# EAGLE schematic New2 (EAGLE 6.1)
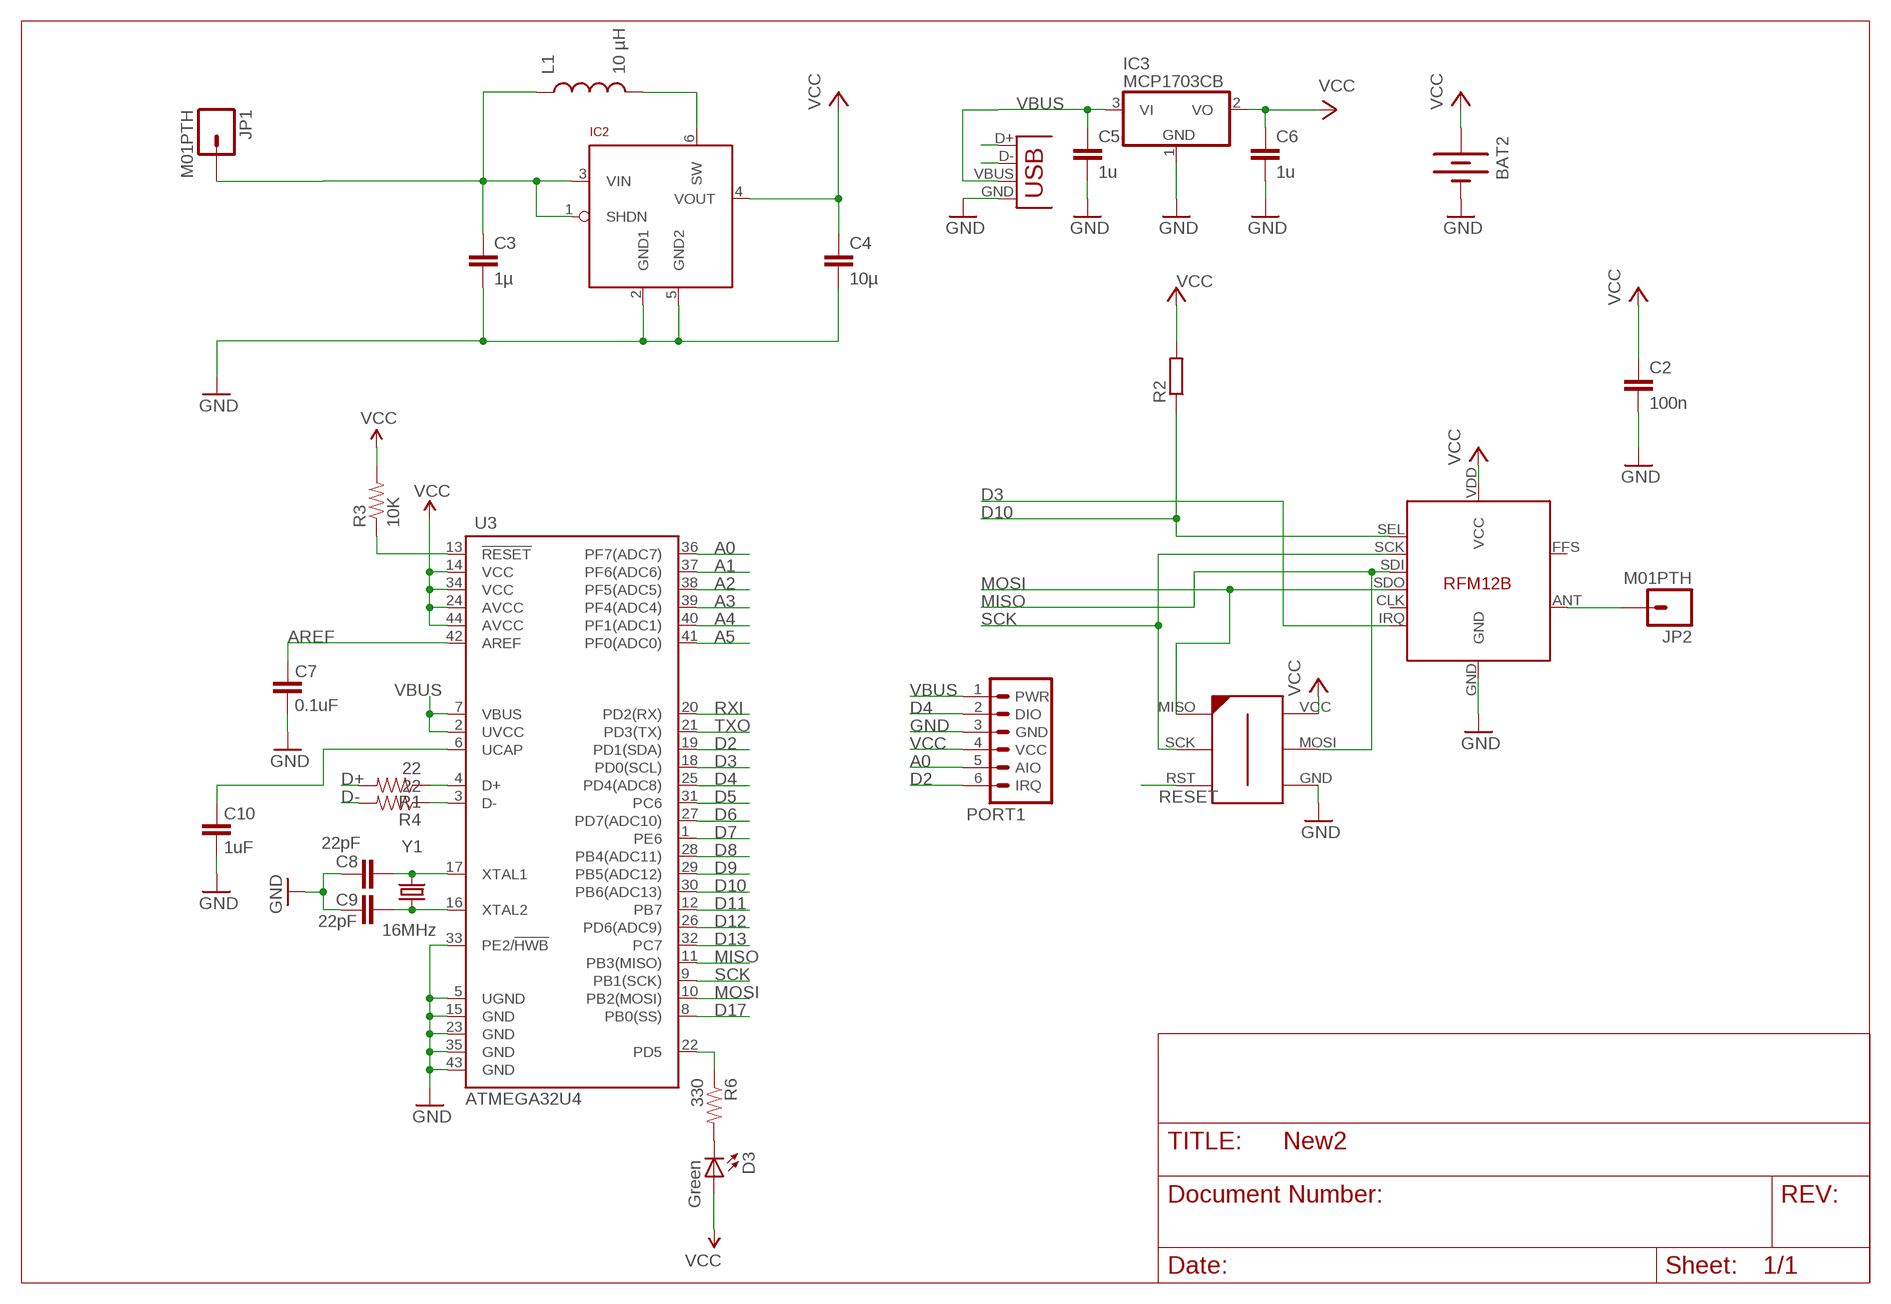
[diagram p0: schematic, sheet 1]

## Parts
BAT2  BATTERY20PTH  [BATTCOM_20MM_PTH]
C2  100n  C-EUC0603K  [C0603K]
C3  1µ  CAP0603-CAP  [0603-CAP]
C4  10µ  CAP0805  [0805]
C5  1u  C-EUC0603K  [C0603K]
C6  1u  C-EUC0603K  [C0603K]
C7  0.1uF  CAP0402-CAP  [0402-CAP]
C8  22pF  CAP0402-CAP  [0402-CAP]
C9  22pF  CAP0402-CAP  [0402-CAP]
C10  1uF  CAP0402-CAP  [0402-CAP]
D3  Green  LED0603  [LED-0603]
IC2  LTC3525  [SC70]
IC3  MCP1703CB  [SOT23]
JP1  M01PTH  [1X01]
JP2  M01PTH  [1X01]
L1  10 µH  INDUCTOR1210  [1210]
PORT1  JEEPORT-FEMALE  [1X06_FEMALE_LOCK.010]
R1  22  RESISTOR0402-RES  [0402-RES]
R2  R-EU_R0402  [R0402]
R3  10K  RESISTOR0402-RES  [0402-RES]
R4  22  RESISTOR0402-RES  [0402-RES]
R6  330  RESISTOR0402-RES  [0402-RES]
U3  ATMEGA32U4  ATMEGA32U4QFN2  [QFN-44-NOPAD]
U$1  RFM12B  [RFM12B]
U$2  AVR-ISP-6-EDGE  [6PAD_ISP]
X1  USB-MICROB  [USB-MICROB]
Y1  16MHz  CRYSTAL5X3  [CRYSTAL-SMD-5X3]

## Nets
A0: PORT1.5(AIO) U3.36(PF7(ADC7))
A1: U3.37(PF6(ADC6))
A2: U3.38(PF5(ADC5))
A3: U3.39(PF4(ADC4))
A4: U3.40(PF1(ADC1))
A5: U3.41(PF0(ADC0))
AREF: C7.2 U3.42(AREF)
D2: PORT1.6(IRQ) U3.19(PD1(SDA))
D3: U3.18(PD0(SCL)) U$1.IRQ
D4: PORT1.2(DIO) U3.25(PD4(ADC8))
D5: U3.31(PC6)
D6: U3.27(PD7(ADC10))
D7: U3.1(PE6)
D8: U3.28(PB4(ADC11))
D9: U3.29(PB5(ADC12))
D10: R2.1 U3.30(PB6(ADC13)) U$1.SEL
D11: U3.12(PB7)
D12: U3.26(PD6(ADC9))
D13: U3.32(PC7)
D17: U3.8(PB0(SS))
D+: R1.2 X1.D+
D-: R4.2 X1.D-
GND: BAT2.2(-) C2.2 C3.2 C4.2 C5.2 C6.2 C7.1 C8.2 C9.2 C10.1 IC2.2(GND1) IC2.5(GND2) IC3.1(GND) PORT1.3(GND) U3.5(UGND) U3.15(GND) U3.23(GND) U3.33(PE2/!HWB) U3.35(GND) U3.43(GND) U$1.GND U$2.GND X1.GND
MISO: U3.11(PB3(MISO)) U$1.SDI U$2.MOSI
MOSI: U3.10(PB2(MOSI)) U$1.SDO U$2.MISO
N$1: C9.1 U3.16(XTAL2) Y1.1
N$2: R1.1 U3.4(D+)
N$3: JP2.1 U$1.ANT
N$4: C8.1 U3.17(XTAL1) Y1.3
N$5: C10.2 U3.6(UCAP)
N$6: D3.C R6.2
N$7: R4.1 U3.3(D-)
N$13 [vcc]: IC2.6(SW) L1.2
RESET: R3.1 U3.13(!RESET) U$2.RST
RXI: U3.20(PD2(RX))
SCK: U3.9(PB1(SCK)) U$1.SCK U$2.SCK
TXLED: R6.1 U3.22(PD5)
TXO: U3.21(PD3(TX))
VBUS: C5.1 IC3.3(VI) PORT1.1(PWR) U3.2(UVCC) U3.7(VBUS) X1.VBUS
VCC: BAT2.1(+) C2.1 C4.1 C6.1 D3.A IC2.4(VOUT) IC3.2(VO) PORT1.4(VCC) R2.2 R3.2 U3.14(VCC) U3.24(AVCC) U3.34(VCC) U3.44(AVCC) U$1.VDD(VCC) U$2.VCC
VIN: C3.1 IC2.1(SHDN) IC2.3(VIN) JP1.1 L1.1
Unconnected: U$1.CLK U$1.FFS

## Library data of the parts
BAT2 = SparkFun:BATTERY: Battery Holders Various common sizes : AA, AAA, 20mm coin cell and 12mm coin cell.
C2 C5 C6 = rcl:C-EU: CAPACITOR, European symbol
C3 C4 C7-C10 = SparkFun:CAP: Capacitor Standard 0603 ceramic capacitor, and 0.1" leaded capacitor.
D3 = SparkFun:LED: LEDs Standard schematic elements and footprints for 5mm, 3mm, 1206, and 0603 sized LEDs. 5mm - Spark Fun Electronics SKU : COM-00529 (and others)
IC2 = JeeLabs:LTC3525
IC3 = linear:MCP1703: 250 mA, 16V, Low Quiescent Current LDO Regulator Source: http://ww1.microchip.com/downloads/en/DeviceDoc/22049b.pdf
JP1 JP2 = SparkFun:M01: Header 1 Standard 1-pin 0.1" header. Use with straight break away headers (SKU : PRT-00116), right angle break away headers (PRT-00553), swiss pins (PRT-00743), machine pins (PRT-00117), and female headers (PRT-00115).
L1 = SparkFun:INDUCTOR: Inductors Basic Inductor/Choke - 0603 and 1206. Footprints are not proven and vary greatly between part numbers.
PORT1 = JeeParts:JEEPORT: PIN HEADER
R1 R3 R4 R6 = SparkFun:RESISTOR: Resistor Basic schematic elements and footprints for 0603, 1206, and PTH resistors.
R2 = resistor:R-EU_: RESISTOR, European symbol
U3 = SparkFun:ATMEGA32U4
U$1 = JeeParts:RFM12B
U$2 = avr-7:AVR-ISP-6-EDGE: 6 pin edge connector for ISP with ATMEL MCUs. Developed by Craig Moates (craig at moates dot net). Library by David Blundell (blundar at gmail dot com). Often, even a 6 pin header is really inconvenient for board layout and/or production. This SMD-only header is our de-facto standard for using an edge connector for programming with the help of a 6pin/10pin to edge card adapter.
X1 = SparkFun:USB: USB Connectors USB-B-PTH is fully proven SKU : PRT-00139 USB-miniB is fully proven SKU : PRT-00587 USB-A-PCB is untested. USB-A-H is throughly reviewed, but untested. Spark Fun Electronics SKU : PRT-00437 USB-B-SMT is throughly reviewed, but untested. Needs silkscreen touching up. USB-A-S has not been used/tested USB-MB-H has not been used/tested
Y1 = SparkFun:CRYSTAL: Crystals Various standard crystals. Proven footprints. Spark Fun Electronics SKU : COM-00534

## Net classes
0 default: width 0.203 mm